# EAGLE design Control (EAGLE 7.5.0)
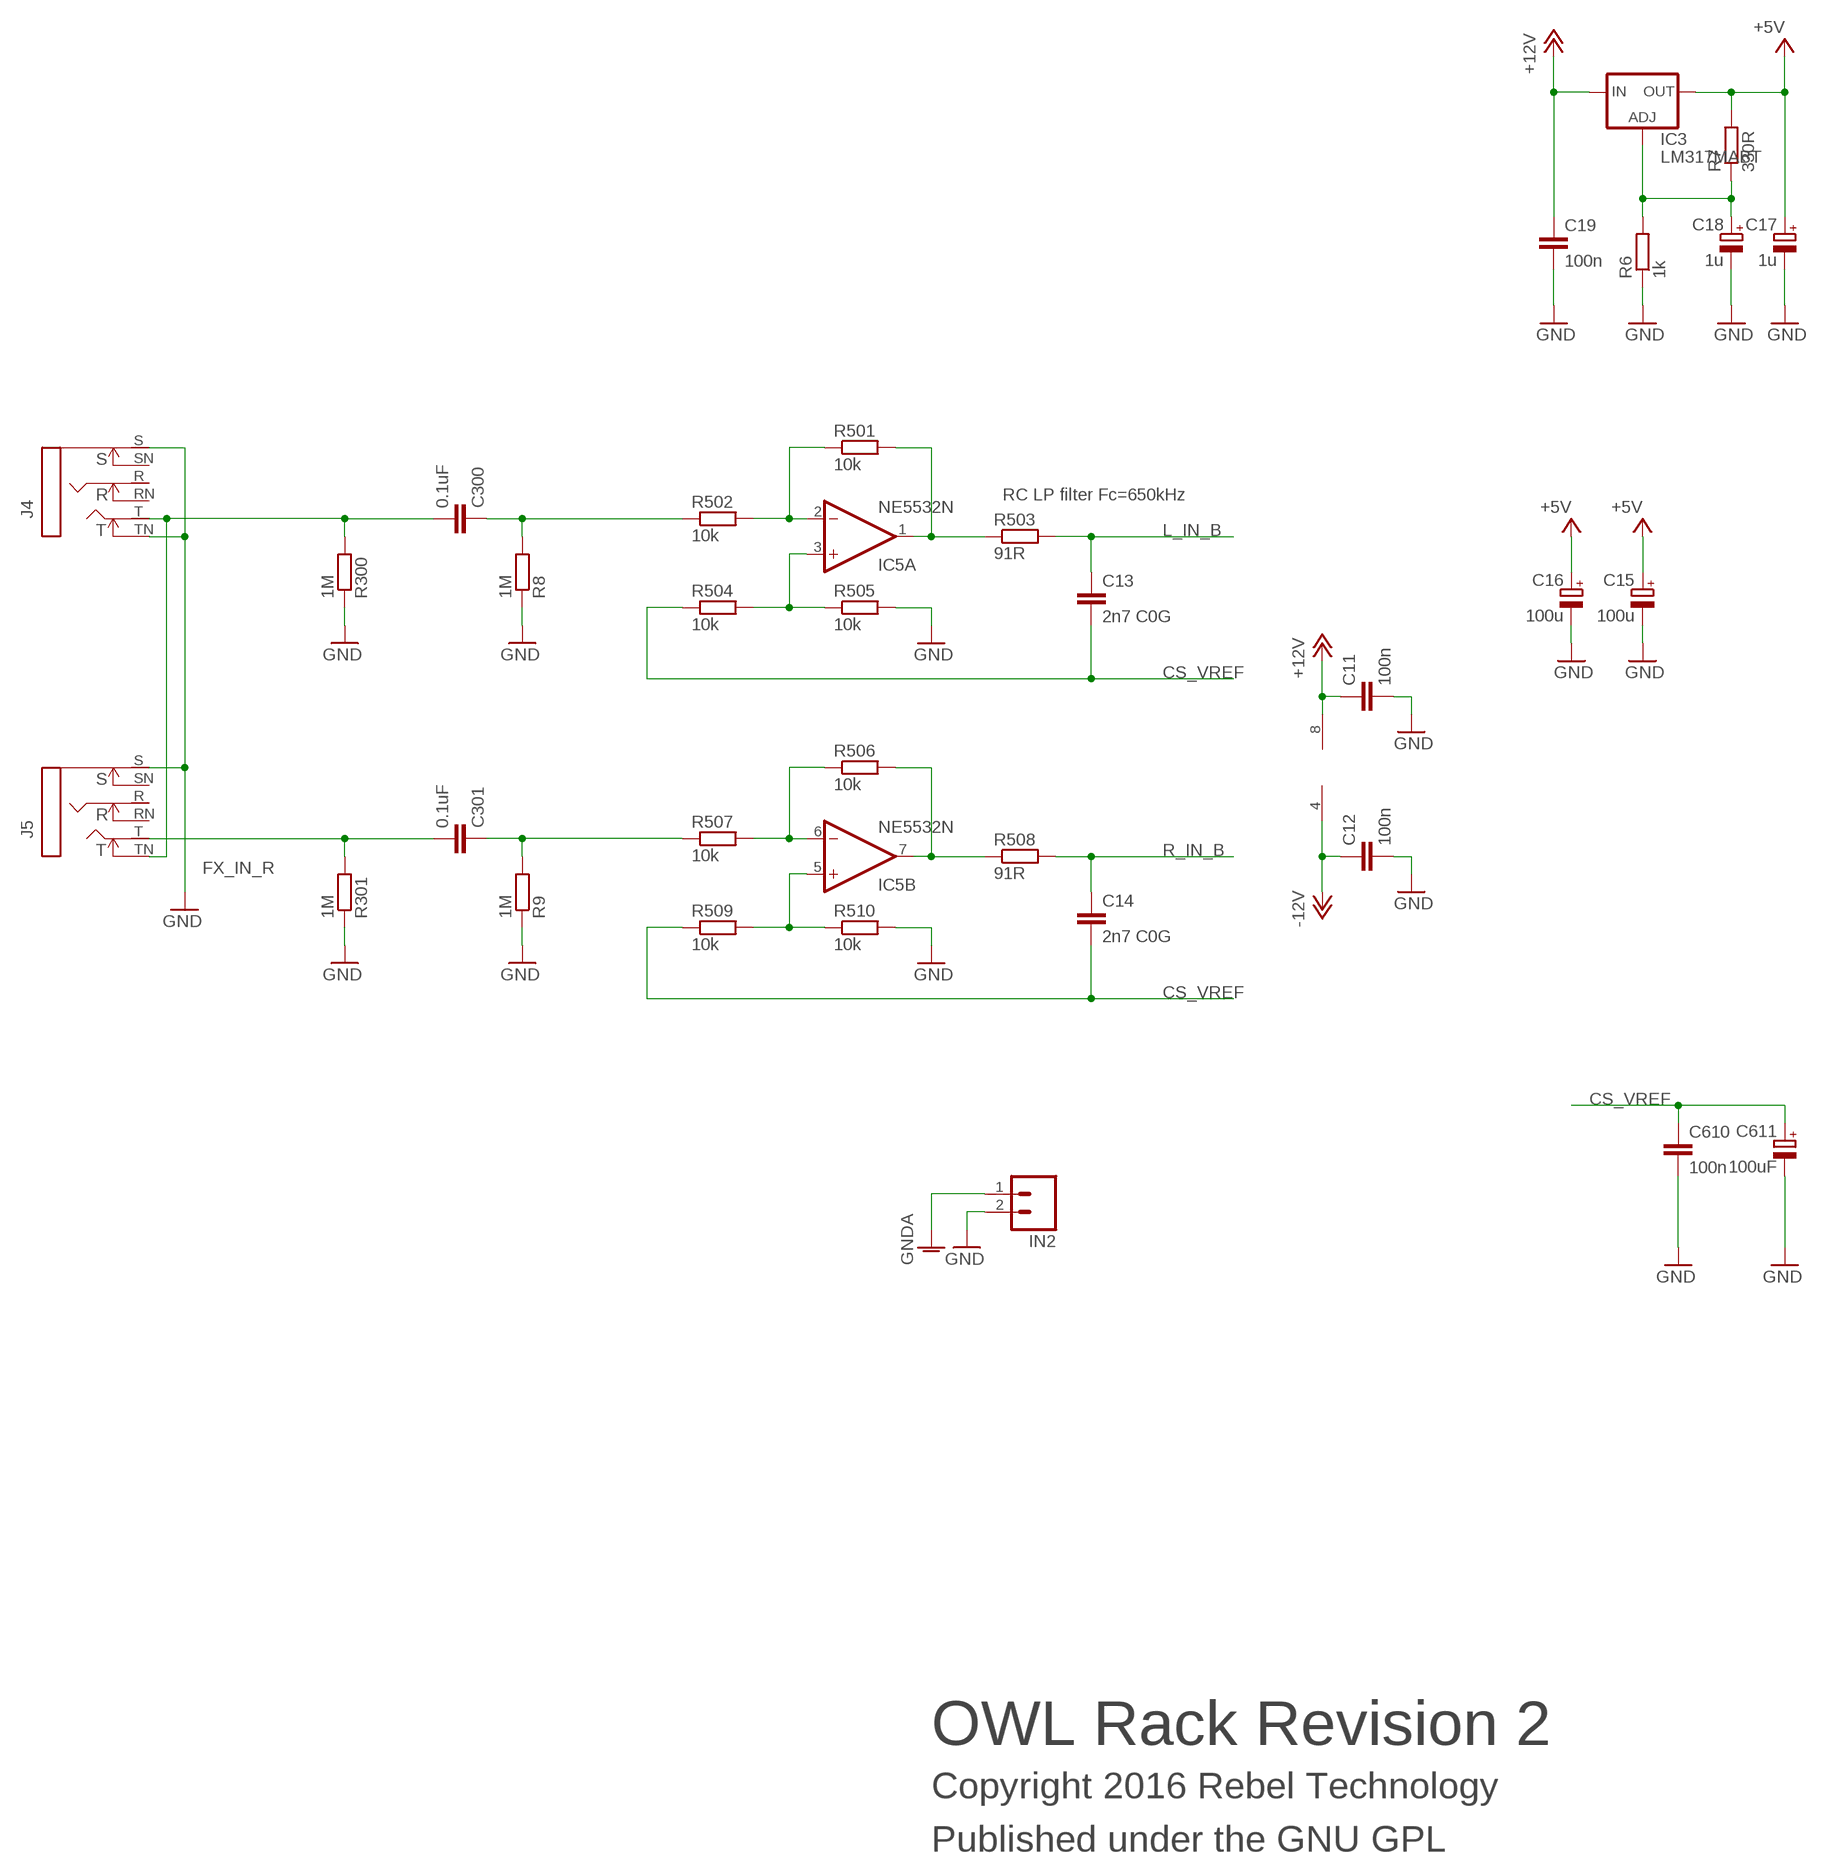
[diagram p0: schematic, sheet 1, part 1 of 2]
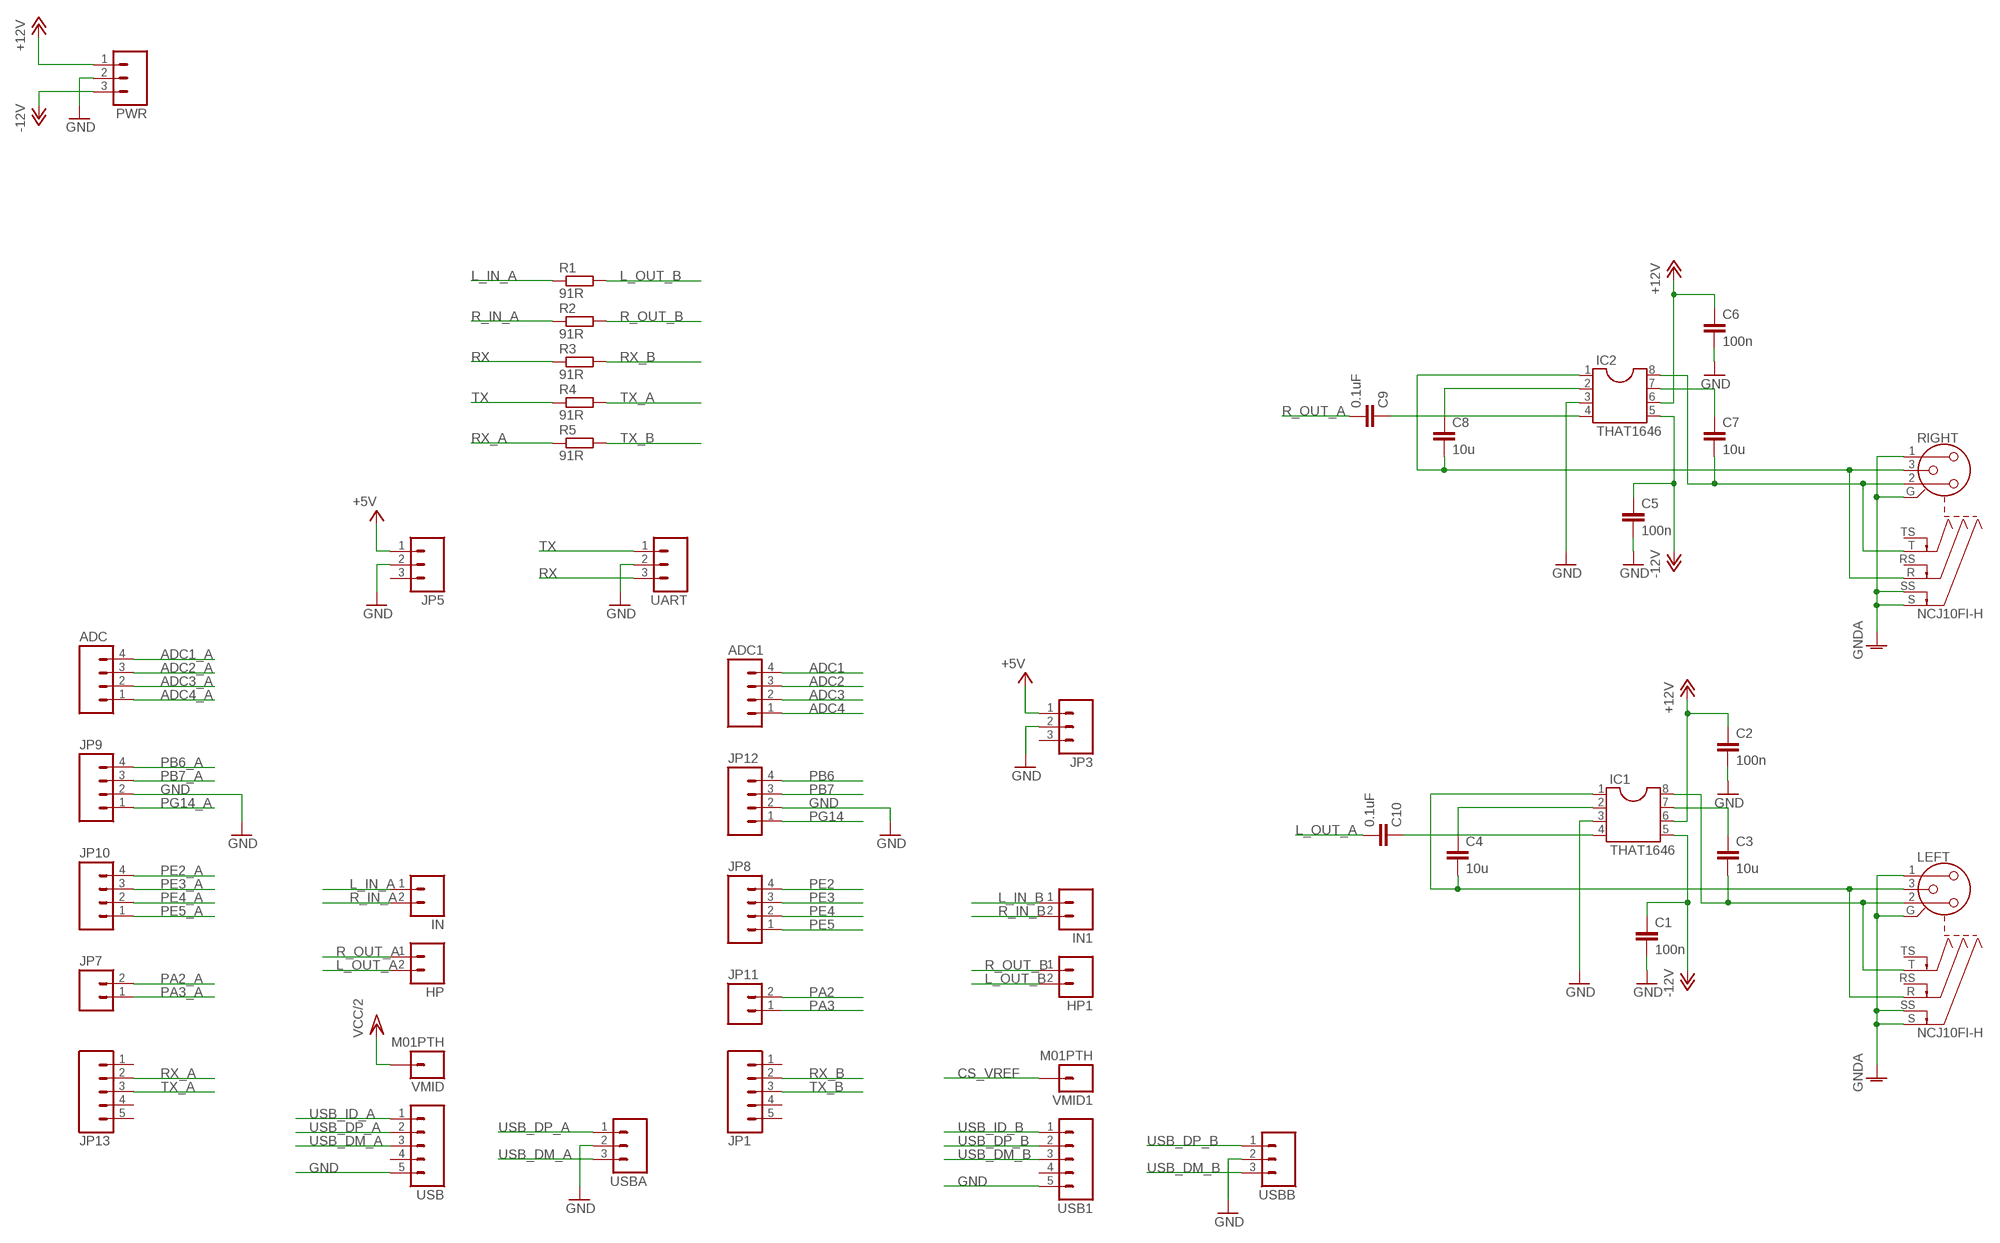
[diagram p1: schematic, sheet 1, part 2 of 2]

## Parts
ADC  M04PTH  [1X04]
ADC1  M04PTH  [1X04]
C1  100n  C-EU050-025X075  [C050-025X075]
C2  100n  C-EU050-025X075  [C050-025X075]
C3  10u  C-EU050-025X075  [C050-025X075]
C4  10u  C-EU050-025X075  [C050-025X075]
C5  100n  C-EU050-025X075  [C050-025X075]
C6  100n  C-EU050-025X075  [C050-025X075]
C7  10u  C-EU050-025X075  [C050-025X075]
C8  10u  C-EU050-025X075  [C050-025X075]
C9  0.1uF  C5/3.5  [C5B3.5]
C10  0.1uF  C5/3.5  [C5B3.5]
C11  100n  C-EU050-025X075  [C050-025X075]
C12  100n  C-EU050-025X075  [C050-025X075]
C13  2n7 C0G  C-EU050-025X075  [C050-025X075]
C14  2n7 C0G  C-EU050-025X075  [C050-025X075]
C15  100u  CPOL-EUE2.5-7  [E2,5-7]
C16  100u  CPOL-EUE2.5-7  [E2,5-7]
C17  1u  CPOL-EUE2.5-7  [E2,5-7]
C18  1u  CPOL-EUE2.5-7  [E2,5-7]
C19  100n  C-EU050-025X075  [C050-025X075]
C300  0.1uF  C5/3.5  [C5B3.5]
C301  0.1uF  C5/3.5  [C5B3.5]
C610  100n  C-EU050-025X075  [C050-025X075]
C611  100uF  CPOL-EUE2.5-7  [E2,5-7]
HP  M02PTH  [1X02]
HP1  M02PTH  [1X02]
IC1  THAT1646  DIL8  [DIL08]
IC2  THAT1646  DIL8  [DIL08]
IC3  LM317MABT  [TO220L1]
IC5  NE5532N  [DIL08]
IN  M02PTH  [1X02]
IN1  M02PTH  [1X02]
IN2  M02PTH  [1X02]
J4  NEUTRIK_NMJ6HCD2  [NMJ6HCD2]
J5  NEUTRIK_NMJ6HCD2  [NMJ6HCD2]
JP1  M05PTH  [1X05]
JP3  M03PTH  [1X03]
JP5  M03PTH  [1X03]
JP7  M02PTH  [1X02]
JP8  M04PTH  [1X04]
JP9  M04PTH  [1X04]
JP10  M04PTH  [1X04]
JP11  M02PTH  [1X02]
JP12  M04PTH  [1X04]
JP13  M05PTH  [1X05]
LEFT  NCJ10FI-H  [NCJ10FI-H]
PWR  M03PTH  [1X03]
R1  91R  R-EU_0204/7  [0204/7]
R2  91R  R-EU_0204/7  [0204/7]
R3  91R  R-EU_0204/7  [0204/7]
R4  91R  R-EU_0204/7  [0204/7]
R5  91R  R-EU_0204/7  [0204/7]
R6  1k  R-EU_0204/7  [0204/7]
R7  330R  R-EU_0204/7  [0204/7]
R8  1M  R-EU_0204/7  [0204/7]
R9  1M  R-EU_0204/7  [0204/7]
R300  1M  R-EU_0204/7  [0204/7]
R301  1M  R-EU_0204/7  [0204/7]
R501  10k  R-EU_0204/7  [0204/7]
R502  10k  R-EU_0204/7  [0204/7]
R503  91R  R-EU_0204/7  [0204/7]
R504  10k  R-EU_0204/7  [0204/7]
R505  10k  R-EU_0204/7  [0204/7]
R506  10k  R-EU_0204/7  [0204/7]
R507  10k  R-EU_0204/7  [0204/7]
R508  91R  R-EU_0204/7  [0204/7]
R509  10k  R-EU_0204/7  [0204/7]
R510  10k  R-EU_0204/7  [0204/7]
RIGHT  NCJ10FI-H  [NCJ10FI-H]
UART  M03PTH  [1X03]
USB  M05PTH  [1X05]
USB1  M05PTH  [1X05]
USBA  M03PTH  [1X03]
USBB  M03PTH  [1X03]
VMID  M01PTH  [1X01]
VMID1  M01PTH  [1X01]

## Nets
+5V: C15.+ C16.+ C17.+ IC3.2(OUT) JP3.1 JP5.1 R7.2
+12V: C2.1 C6.1 C11.1 C19.1 IC1.6 IC2.6 IC3.3(IN) IC5.8(P:V+) PWR.1
-12V: C1.1 C5.1 C12.1 IC1.5 IC2.5 IC5.4(P:V-) PWR.3
ADC1: ADC1.4
ADC1_A: ADC.4
ADC2: ADC1.3
ADC2_A: ADC.3
ADC3: ADC1.2
ADC3_A: ADC.2
ADC4: ADC1.1
ADC4_A: ADC.1
CS_VREF: C13.2 C14.2 C610.1 C611.+ R504.1 R509.1 VMID1.1
FX_IN_L: C300.2 J4.T J5.TN R300.2
FX_IN_R: C301.2 J5.T R301.2
GND: C1.2 C2.2 C5.2 C6.2 C11.2 C12.2 C15.- C16.- C17.- C18.- C19.2 C610.2 C611.- IC1.3 IC2.3 IN2.2 J4.S J4.TN J5.S JP3.2 JP5.2 JP9.2 JP12.2 PWR.2 R6.1 R8.1 R9.1 R300.1 R301.1 R505.2 R510.2 UART.2 USB1.5 USB.5 USBA.2 USBB.2
GNDA: IN2.1 LEFT.1 LEFT.G LEFT.S LEFT.SS RIGHT.1 RIGHT.G RIGHT.S RIGHT.SS
L_IN_A: IN.1 R1.1
L_IN_B: C13.1 IN1.1 R503.2
L_OUT_A: C10.2 HP.2
L_OUT_B: HP1.2 R1.2
N$1: IC5.7(B:OUT) R506.2 R508.1
N$2: C3.2 IC1.8 LEFT.2 LEFT.T
N$3: C4.2 IC1.1 LEFT.3 LEFT.R
N$4: C3.1 IC1.7
N$5: C4.1 IC1.2
N$7: C9.1 IC2.4
N$8: C7.1 IC2.7
N$9: C10.1 IC1.4
N$10: C8.1 IC2.2
N$11: C18.+ IC3.1(ADJ) R6.2 R7.1
N$18: C7.2 IC2.8 RIGHT.2 RIGHT.T
N$19: C8.2 IC2.1 RIGHT.3 RIGHT.R
N$26: C300.1 R8.2 R502.1
N$30: C301.1 R9.2 R507.1
N$36: IC5.3(A:+IN) R504.2 R505.1
N$38: IC5.2(A:-IN) R501.1 R502.2
N$40: IC5.1(A:OUT) R501.2 R503.1
N$42: IC5.5(B:+IN) R509.2 R510.1
N$43: IC5.6(B:-IN) R506.1 R507.2
PA2: JP11.2
PA2_A: JP7.2
PA3: JP11.1
PA3_A: JP7.1
PB6: JP12.4
PB6_A: JP9.4
PB7: JP12.3
PB7_A: JP9.3
PE2: JP8.4
PE2_A: JP10.4
PE3: JP8.3
PE3_A: JP10.3
PE4: JP8.2
PE4_A: JP10.2
PE5: JP8.1
PE5_A: JP10.1
PG14: JP12.1
PG14_A: JP9.1
R_IN_A: IN.2 R2.1
R_IN_B: C14.1 IN1.2 R508.2
R_OUT_A: C9.2 HP.1
R_OUT_B: HP1.1 R2.2
RX: R3.1 UART.3
RX_A: JP13.2 R5.1
RX_B: JP1.2 R3.2
TX: R4.1 UART.1
TX_A: JP13.3 R4.2
TX_B: JP1.3 R5.2
USB_DM_A: USB.3 USBA.3
USB_DM_B: USB1.3 USBB.3
USB_DP_A: USB.2 USBA.1
USB_DP_B: USB1.2 USBB.1
USB_ID_A: USB.1
USB_ID_B: USB1.1
VCC/2: VMID.1
Unconnected: J4.R J4.RN J4.SN J5.R J5.RN J5.SN JP1.1 JP1.4 JP1.5 JP3.3 JP5.3 JP13.1 JP13.4 JP13.5 LEFT.RS LEFT.TS RIGHT.RS RIGHT.TS USB1.4 USB.4

## Notes on the sheet
- RC LP filter Fc=650kHz
- OWL Rack Revision 2
- Copyright 2016 Rebel Technology
- Published under the GNU GPL

## Library data of the parts
ADC ADC1 JP8-JP10 JP12 = SparkFun:M04: Header 4 Standard 4-pin 0.1" header. Use with straight break away headers (SKU : PRT-00116), right angle break away headers (PRT-00553), swiss pins (PRT-00743), machine pins (PRT-00117), and female headers (PRT-00115). Molex polarized connector foot print use with SKU : PRT-08231 with associated crimp pins and housings. 1MM SMD Version SKU: PRT-10208
C1-C8 C11-C14 C19 C610 = rcl:C-EU: CAPACITOR, European symbol
C9 C10 C300 C301 = capacitor-wima:C: CAPACITOR naming: grid - package width
C15-C18 C611 = rcl:CPOL-EU: POLARIZED CAPACITOR, European symbol
HP HP1 IN IN1 IN2 JP7 JP11 = SparkFun:M02: Header 2 Standard 2-pin 0.1" header. Use with straight break away headers (SKU : PRT-00116), right angle break away headers (PRT-00553), swiss pins (PRT-00743), machine pins (PRT-00117), and female headers (PRT-00115). Molex polarized connector foot print use with SKU : PRT-08233 with associated crimp pins and housings.
IC1 IC2 = ic-package:DIL8: Dual In Line / Socket
IC3 = v-reg:LM317?*: 500 mA Adjustable Output Positive Voltage Regulator Source: http://www.onsemi.co.jp .. LM317M-D.PDF
IC5 = linear:NE5532: AUDIO AMPLIFIER
J4 J5 = neutrik_jacks:NEUTRIK_NMJ6HCD2
JP1 JP13 USB USB1 = SparkFun:M05: Header 5 Standard 5-pin 0.1" header. Use with straight break away headers (SKU : PRT-00116), right angle break away headers (PRT-00553), swiss pins (PRT-00743), machine pins (PRT-00117), and female headers (PRT-00115). Molex polarized connector foot print use with SKU : PRT-08230 with associated crimp pins and housings.
JP3 JP5 PWR UART USBA USBB = SparkFun:M03: Header 3 Standard 3-pin 0.1" header. Use with straight break away headers (SKU : PRT-00116), right angle break away headers (PRT-00553), swiss pins (PRT-00743), machine pins (PRT-00117), and female headers (PRT-00115). Molex polarized connector foot print use with SKU : PRT-08232 with associated crimp pins and housings.
LEFT RIGHT = con-neutrik_ag:NCJ10FI-: Neutrik Audio Connector XLR SERIES Stereo 1/4" jack with switch Source: www.neutrik.com/; OC_FARNELL: unknown; OC_NEWARK: unknown
R1-R9 R300 R301 R501-R510 = Rebel:R-EU_: RESISTOR, European symbol
VMID VMID1 = SparkFun:M01: Header 1 Standard 1-pin 0.1" header. Use with straight break away headers (SKU : PRT-00116), right angle break away headers (PRT-00553), swiss pins (PRT-00743), machine pins (PRT-00117), and female headers (PRT-00115).

## Board
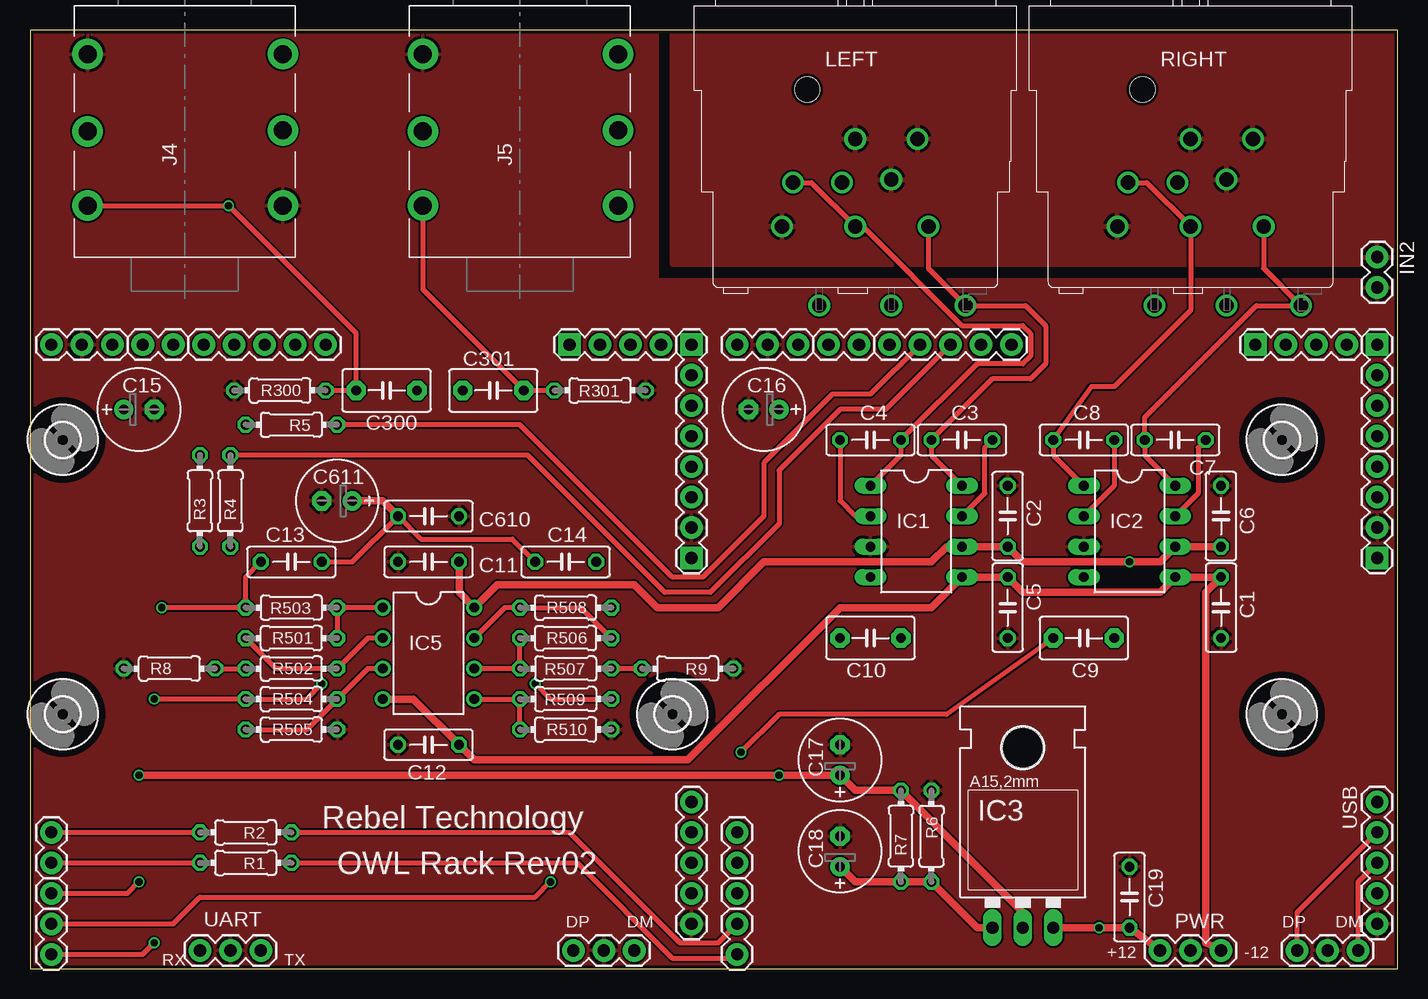
[diagram p2: board, top side]
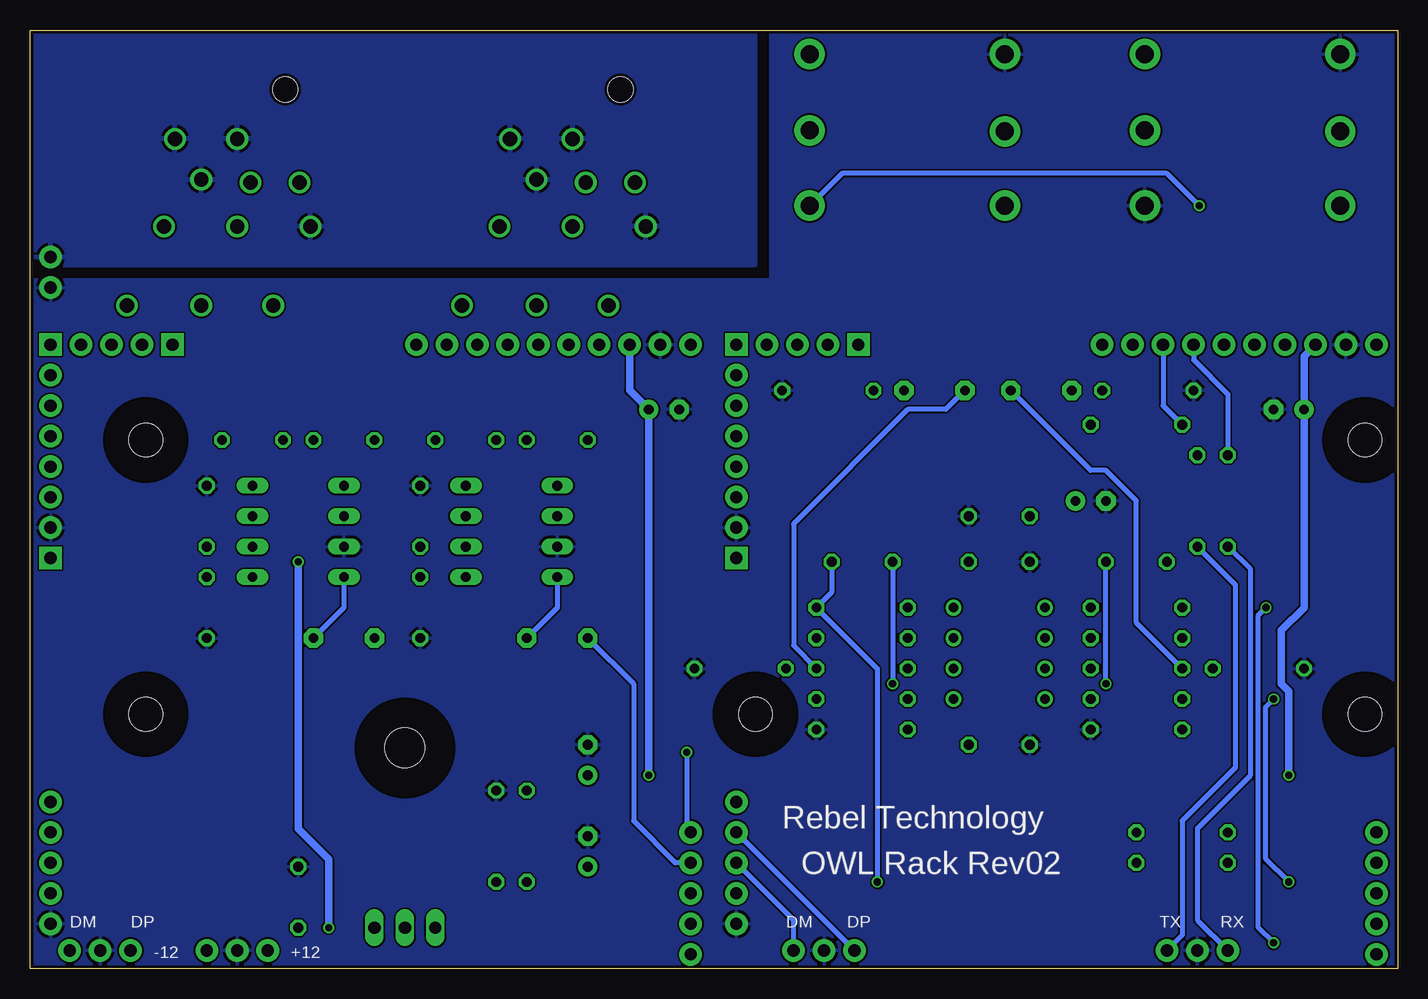
[diagram p3: board, bottom side, seen from below]

Size 113.98 x 78.23 mm. Coordinates in mm from the lower left corner, seen from the top.
Outline: 0,0 113.98,0 113.98,78.23 0,78.23 0,0
Copper layers (1*16): Top 0.035mm / dielectric 1.5mm / Bottom 0.035mm
Design rules "Rebel *": minimum track width 6mil, minimum drill 12mil, track to track 6mil, track to pad 6mil, pad to pad 6mil, via to via 6mil, smd to smd 0mil, copper to edge 10mil, drill to drill 10mil, minimum pad ring 10mil, minimum via ring 6mil, stop-mask expansion 2mil, vias tented up to drill 100mil, thermal gap 10mil

### Footprints (pad centres in the part's own frame; a part is rotated, then mirrored left to right if it is on the bottom)
1X04 = drill 1.016 pad 1.88 square: 1 0,0 | drill 1.016 pad 1.88: 2 2.54,0; 3 5.08,0; 4 7.62,0
C050-025X075 = drill 0.813 octagon: 1 -2.54,0; 2 2.54,0
C5B3.5 = drill 0.813 pad 1.6 octagon: 1 -2.54,0; 2 2.54,0
E2,5-7 = drill 0.813 pad 1.6: + -1.27,0 | drill 0.813 pad 1.6 octagon: - 1.27,0
1X02 = drill 1.016 pad 1.88: 1 0,0; 2 2.54,0
DIL08 = drill 0.813 long: 1 -3.81,-3.81; 2 -1.27,-3.81; 3 1.27,-3.81; 4 3.81,-3.81; 5 3.81,3.81; 6 1.27,3.81; 7 -1.27,3.81; 8 -3.81,3.81
TO220L1 = drill 1.016 long: 1 -2.54,-3.81; 2 0,-3.81; 3 2.54,-3.81 | hole 3.302: 0,11.176
DIL08' = drill 0.813 pad 1.27: 1 -3.81,-3.81; 2 -1.27,-3.81; 3 1.27,-3.81; 4 3.81,-3.81; 5 3.81,3.81; 6 1.27,3.81; 7 -1.27,3.81; 8 -3.81,3.81
NMJ6HCD2 = drill 1.5 pad 2.54: R -0.318,8.096; RN -0.238,-8.176; S 6.112,8.096; SN 6.112,-8.176; T -6.509,8.096; TN -6.509,-8.176
1X05 = drill 1.016 pad 1.88: 1 0,0; 2 2.54,0; 3 5.08,0; 4 7.62,0; 5 10.16,0
1X03 = drill 1.016 pad 1.88: 1 0,0; 2 2.54,0; 3 5.08,0
NCJ10FI-H = drill 1.2: 1 -6.1,-18.4; 2 6.1,-18.4; 3 0,-18.4; G 0,-11.1; GN -1.1,-14.75; R -5.2,-14.75; RS -3,-25; S 5.2,-11.1; SS 3,-14.5; T 9.2,-25; TS 3,-25 | hole 2.1: -4,-7
0204/7 = drill 0.813 octagon: 1 -3.81,0; 2 3.81,0
2,8 = hole 2.8: 0,0
1X01 = drill 1.016 pad 1.88: 1 0,0

### Placement (x,y rotation side)
ADC  112.27,52.01 270 top
ADC1  55.12,52.01 270 top
C1  99.25,30.1 270 top
C2  81.47,37.72 90 top
C3  77.66,44.07 180 top
C4  70.04,44.07 0 top
C5  81.47,30.1 270 top
C6  99.25,37.72 90 top
C7  95.44,44.07 180 top
C8  87.82,44.07 180 top
C9  87.82,27.56 180 top
C10  70.04,27.56 180 top
C11  33.21,33.91 180 top
C12  33.21,18.67 180 top
C13  21.78,33.91 0 top
C14  44.64,33.91 180 top
C15  9.08,46.61 0 top
C16  61.15,46.61 180 top
C17  67.5,17.4 90 top
C18  67.5,9.78 90 top
C19  91.63,5.97 90 top
C300  29.72,48.2 180 top
C301  38.61,48.2 0 top
C610  33.21,37.72 0 top
C611  25.59,38.99 180 top
HP  58.93,11.37 270 top
HP1  1.78,11.37 270 top
IC1  73.85,36.45 270 top
IC2  91.63,36.45 270 top
IC3  82.74,7.24 0 top
IC5  NE5532N  [DIL08']  33.21,26.29 270 top
IN  58.93,1.21 90 top
IN1  1.78,1.21 90 top
IN2  112.27,59.31 270 top
J4  12.89,70.1 90 top
J5  40.83,70.1 90 top
JP1  14.48,52.01 0 top
JP3  6.86,52.01 180 top
JP5  64.01,52.01 180 top
JP7  66.55,52.01 0 top
JP8  44.96,52.01 0 top
JP9  112.27,34.23 90 top
JP10  102.11,52.01 0 top
JP11  9.4,52.01 0 top
JP12  55.12,34.23 90 top
JP13  71.63,52.01 0 top
LEFT  68.77,80.26 0 top
PWR  94.17,1.52 0 top
R1  17.97,8.83 180 top
R2  17.97,11.37 180 top
R3  14.16,38.99 90 top
R4  16.7,38.99 90 top
R5  21.78,45.34 180 top
R6  75.12,11.05 270 top
R7  72.58,11.05 90 top
R8  11.62,25.02 0 top
R9  54.8,25.02 180 top
R300  20.83,48.2 0 top
R301  47.5,48.2 180 top
R501  21.78,27.56 0 top
R502  21.78,25.02 0 top
R503  21.78,30.1 180 top
R504  21.78,22.48 0 top
R505  21.78,19.94 0 top
R506  44.64,27.56 0 top
R507  44.64,25.02 180 top
R508  44.64,30.1 0 top
R509  44.64,22.48 180 top
R510  44.64,19.94 0 top
RIGHT  96.71,80.26 0 top
U$1  [2,8]  53.53,21.21 0 top
U$3  [2,8]  104.33,21.21 0 top
U$4  [2,8]  2.73,21.21 0 top
U$5  [2,8]  2.73,44.07 0 top
U$6  [2,8]  104.33,44.07 0 top
UART  19.24,1.52 180 top
USB  112.27,13.91 270 top
USB1  55.12,13.91 270 top
USBA  105.6,1.52 0 top
USBB  45.28,1.52 0 top
VMID  58.93,6.29 270 top
VMID1  1.78,6.29 180 top

### Tracks (layer width: path | path; a pad name or v marks a point on that pad's centre or on a via)
+5V  (via drill 0.6)
  Top 0.61: v9.08,16.13 v62.42,16.13 C17.+ 68.77,14.86 R7.2 82.74,4.7 IC3.2
  Bottom 0.61: JP3.1 7.81,51.05 C15.+ 7.81,30.1 9.72,28.19 9.72,23.75 9.08,23.11 v9.08,16.13 | JP5.1 64.01,48.2 C16.+ v62.42,16.13
+12V  (via drill 0.6)
  Top 0.61: C6.1 IC2.6 94.17,33.91 v91.63,33.91 82.74,33.91 C2.1 IC1.6 76.39,35.18 75.12,33.91 61.15,33.91 57.34,30.1 52.26,30.1 50.36,32 38.93,32 IC5.8 35.75,31.37 C11.1 | IC3.3 v89.09,3.43 C19.1 PWR.1
  Bottom 0.61: v91.63,33.91 91.63,11.68 89.09,9.14 v89.09,3.43
-12V
  Top 0.61: PWR.3 97.98,2.16 97.98,31.37 C1.1 IC2.5 94.17,31.37 82.74,31.37 C5.1 IC1.5 75.12,30.1 67.5,30.1 54.8,17.4 37.02,17.4 C12.1 31.94,22.48 IC5.4
CS_VREF  (via drill 0.6)
  Top 0.406: v24.32,23.75 23.05,22.48 R504.1 v10.35,22.48 | v42.1,23.75 43.37,22.48 R509.1 | VMID1.1 8.13,6.29 v9.08,7.24 | C13.2 26.86,33.91 C610.1 32.58,35.81 40.2,35.81 C14.2
  Top 0.61: C611.+ 29.4,38.99 C610.1
  Bottom 0.406: v24.32,23.75 C13.2 | C14.2 v42.1,23.75 | v9.08,7.24 10.99,9.14 10.99,21.84 v10.35,22.48
FX_IN_L  (via drill 0.6)
  Top 0.406: R300.2 C300.2 27.18,52.96 v16.54,63.59 J4.T
  Bottom 0.406: J5.TN 46.31,66.29 19.24,66.29 v16.54,63.59
FX_IN_R
  Top 0.406: J5.T 32.73,56.61 C301.2 R301.2
GND
  pour Bottom: -8.7,-14.35 -8.7,81.53 52.26,81.53 52.26,57.4 117.98,57.4 117.98,-14.35
  pour Top: -8.7,-14.35 -8.7,81.53 52.26,81.53 52.26,57.4 117.98,57.4 117.98,-14.35
GNDA
  pour Bottom: 53.53,58.67 53.53,80.26 118.3,80.26 118.3,58.67
  pour Top: 53.53,58.67 53.53,80.26 118.3,80.26 118.3,58.67
L_IN_A
  Top 0.406: R1.1 45.59,8.83 53.53,0.89 58.61,0.89 IN.1
L_IN_B  (via drill 0.6)
  Top 0.406: IN1.1 9.4,1.21 v10.35,2.16 | C13.1 17.97,32.64 R503.2 v10.99,30.1
  Bottom 0.406: v10.35,2.16 11.62,3.43 11.62,29.46 v10.99,30.1
L_OUT_A
  Bottom 0.406: C10.2 63.69,23.75 63.69,12.32 60.2,8.83 HP.2
L_OUT_B
  Top 0.406: HP1.2 R1.2
N$1
  Top 0.406: IC5.7 39.56,30.1 R508.1 45.91,30.1 R506.2
N$2
  Top 0.406: IC1.8 75.12,42.8 C3.2 80.2,49.15 83.38,49.15 84.65,50.42 84.65,53.59 82.98,55.26 LEFT.T 74.87,58.36 LEFT.2
N$3
  Top 0.406: IC1.1 72.58,42.8 C4.2 78.93,50.42 82.74,50.42 83.38,51.05 83.38,52.96 82.74,53.59 77.66,53.59 69.39,61.86 LEFT.3 65.12,65.51 LEFT.R
N$4
  Top 0.406: IC1.7 79.57,39.62 79.57,43.43 C3.1
N$5
  Top 0.406: C4.1 67.5,38.99 68.77,37.72 IC1.2
N$7
  Bottom 0.406: IC2.4 87.82,30.1 C9.1
N$8
  Top 0.406: C7.1 97.35,43.43 97.35,39.62 IC2.7
N$9
  Bottom 0.406: IC1.4 70.04,30.1 C10.1
N$10
  Top 0.406: C8.1 90.36,40.26 IC2.2
N$11
  Top 0.61: IC3.1 78.93,3.43 R6.2 R7.1 68.77,7.24 C18.+
N$18
  Top 0.406: IC2.8 92.9,42.8 C7.2 92.9,45.97 102.19,55.26 RIGHT.T 102.81,58.36 RIGHT.2
N$19
  Top 0.406: IC2.1 85.28,42.8 C8.2 88.46,48.51 90.36,48.51 96.71,54.86 RIGHT.3 93.06,65.51 RIGHT.R
N$26
  Top 0.406: R8.2 R502.1
  Bottom 0.406: C300.1 25.59,41.53 24.32,41.53 21.78,38.99 21.78,28.83 R502.1
N$30
  Top 0.406: R9.2 R507.1
  Bottom 0.406: C301.1 37.66,46.61 40.83,46.61 50.36,37.08 50.36,26.92 R507.1
N$36
  Top 0.406: IC5.3 28.13,25.02 R504.2 23.05,19.94 R505.1
N$38
  Top 0.406: IC5.2 28.13,27.56 R502.2 20.51,25.02 R501.1
N$40
  Top 0.406: IC5.1 R503.1 R501.2
N$42
  Top 0.406: IC5.5 R509.2 R510.1
N$43
  Top 0.406: IC5.6 R507.2 R506.1
R_IN_A
  Top 0.406: R2.1 44.96,11.37 54.17,2.16 57.34,2.16 IN.2
R_IN_B  (via drill 0.6)
  Top 0.406: IN1.2 11.94,3.75 14.16,5.97 42.1,5.97 v43.37,7.24
  Bottom 0.406: C14.1 47.18,31.37 R508.2 43.37,25.02 v43.37,7.24
R_OUT_A  (via drill 0.6)
  Top 0.406: C9.2 76.39,21.21 62.42,21.21 v59.25,18.03
  Bottom 0.406: v59.25,18.03 59.25,11.68 HP.1
R_OUT_B
  Top 0.406: HP1.1 R2.2
RX
  Bottom 0.406: R3.1 12.26,33.27 12.26,16.13 16.7,11.68 16.7,4.06 UART.3
RX_A
  Top 0.406: JP13.2 70.04,47.88 66.87,47.88 61.15,42.16 61.15,37.72 56.07,32.64 53.53,32.64 40.83,45.34 R5.1
RX_B
  Bottom 0.406: JP1.2 17.02,50.74 14.16,47.88 R3.2
TX
  Bottom 0.406: R4.1 13.53,32 13.53,16.76 17.97,12.32 17.97,2.79 UART.1
TX_A
  Top 0.406: JP13.3 71.31,46.61 67.5,46.61 62.42,41.53 62.42,37.08 56.71,31.37 52.9,31.37 41.47,42.8 R4.2
TX_B
  Bottom 0.406: JP1.3 19.56,46.93 R5.2
USB_DM_A
  Top 0.406: USBA.3 110.68,7.24 USB.3
USB_DM_B
  Bottom 0.406: USBB.3 50.36,4.06 USB1.3
USB_DP_A
  Top 0.406: USBA.1 105.6,4.7 USB.2
USB_DP_B
  Bottom 0.406: USBB.1 USB1.2

### Text on the board
tPlace: Rebel Technology | OWL Rack Rev02 | DP | DM | DP | DM | RX | TX | +12 | -12
bPlace: Rebel Technology | OWL Rack Rev02 | RX | TX | DP | DM | DP | DM | +12 | -12